# EAGLE design relay-attentuator-SMD (EAGLE 9.6.0)
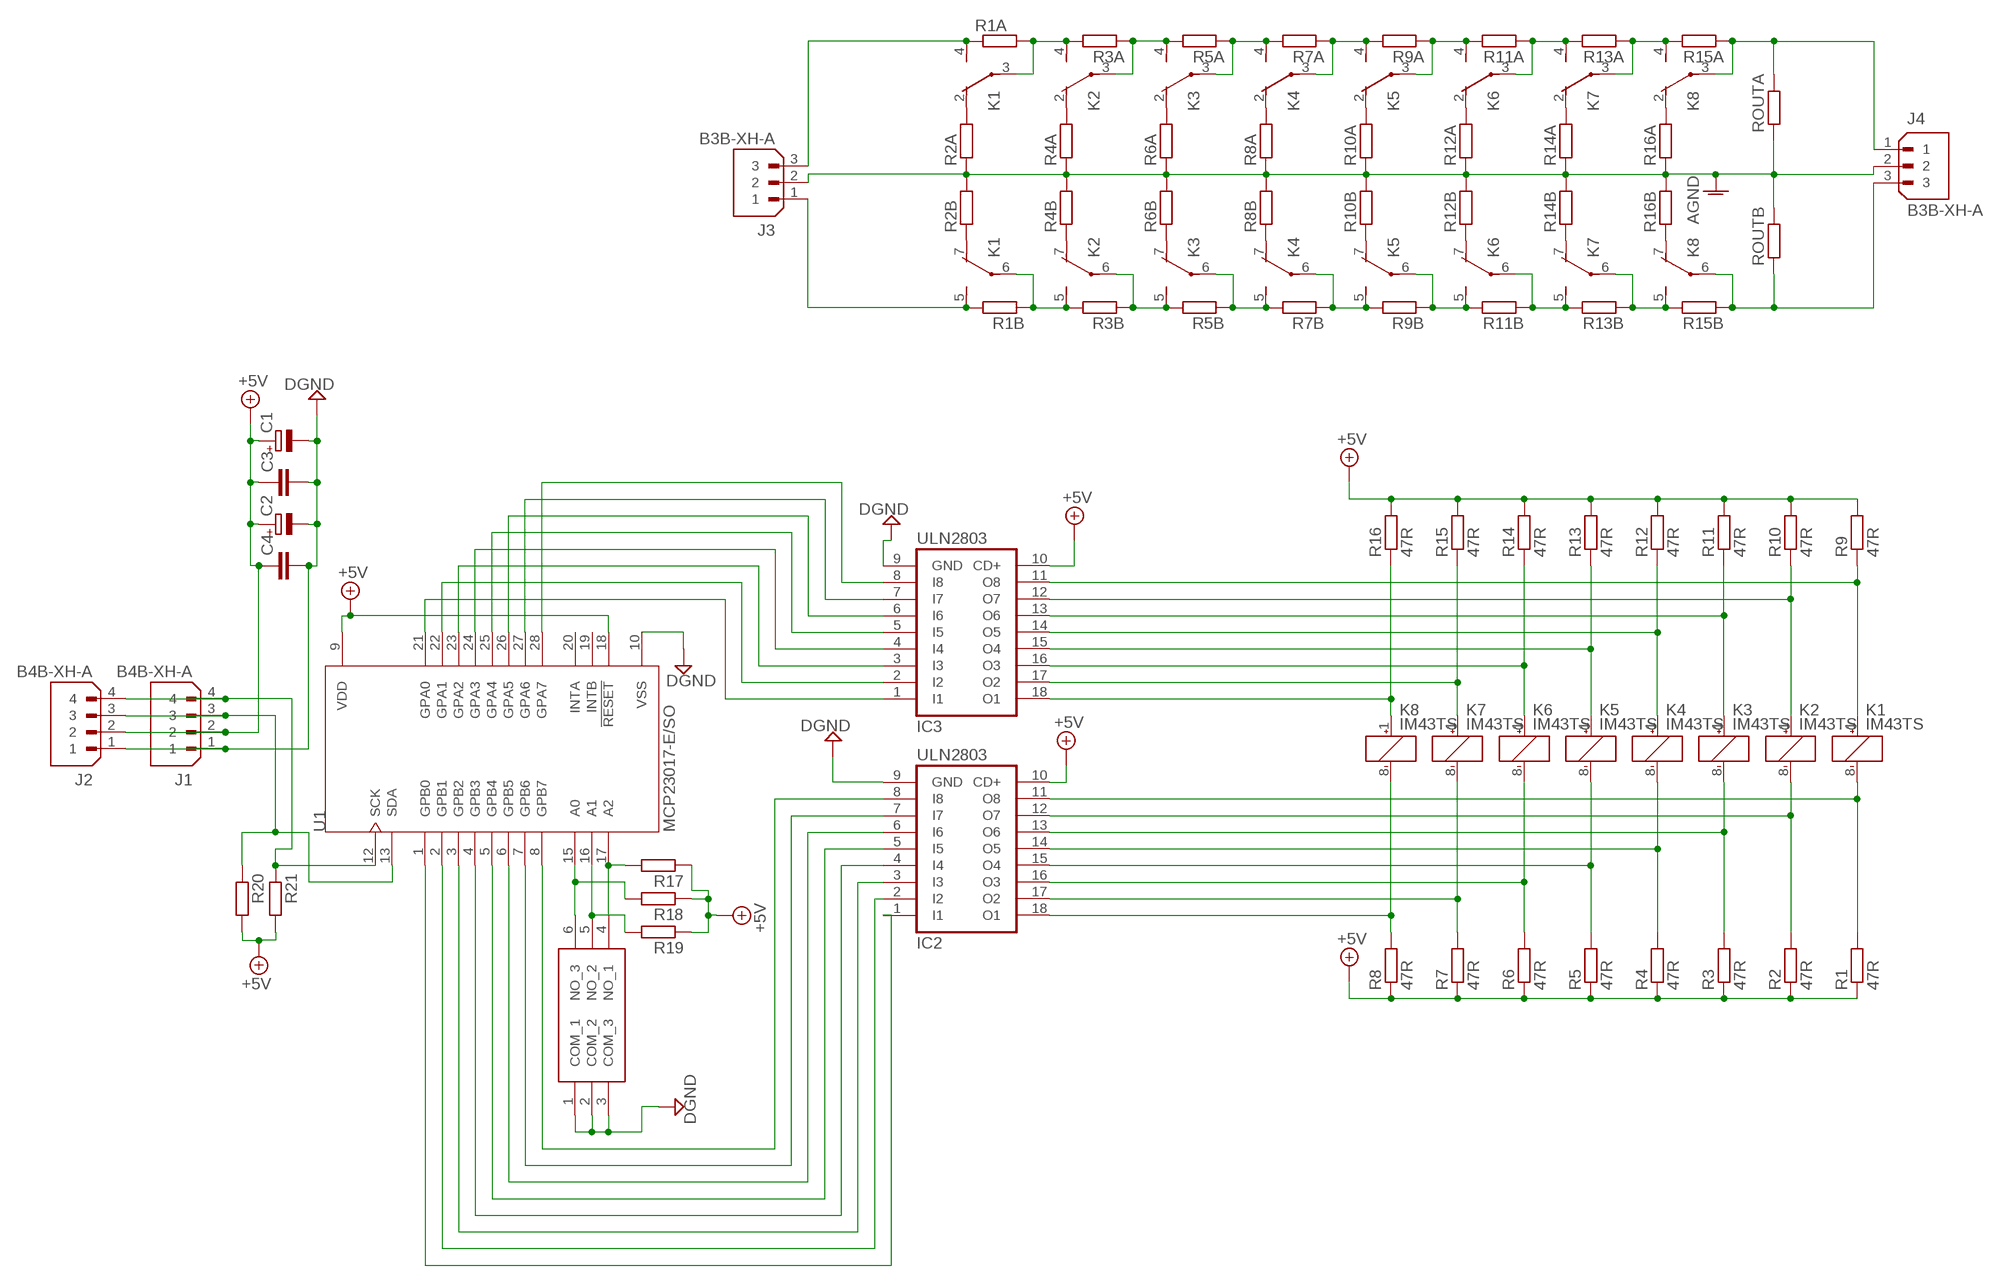
[diagram p0: schematic, sheet 1]

## Parts
C1  CPOL-EUE3.5-8  [E3,5-8]
C2  CPOL-EUE3.5-8  [E3,5-8]
C3  C-EUC1206  [C1206]
C4  C-EUC1206  [C1206]
IC2  ULN2803  ULN2803ADW  [SO-18W]
IC3  ULN2803  ULN2803ADW  [SO-18W]
J1  B4B-XH-A  [JST_B4B-XH-A]
J2  B4B-XH-A  [JST_B4B-XH-A]
J3  B3B-XH-A  [JST_B3B-XH-A]
J4  B3B-XH-A  [JST_B3B-XH-A]
K1  IM43TS  [IM43TS]
K2  IM43TS  [IM43TS]
K3  IM43TS  [IM43TS]
K4  IM43TS  [IM43TS]
K5  IM43TS  [IM43TS]
K6  IM43TS  [IM43TS]
K7  IM43TS  [IM43TS]
K8  IM43TS  [IM43TS]
R1  47R  R-EU_R1206  [R1206]
R1A  R-EU_R1206  [R1206]
R1B  R-EU_R1206  [R1206]
R2  47R  R-EU_R1206  [R1206]
R2A  R-EU_R1206  [R1206]
R2B  R-EU_R1206  [R1206]
R3  47R  R-EU_R1206  [R1206]
R3A  R-EU_R1206  [R1206]
R3B  R-EU_R1206  [R1206]
R4  47R  R-EU_R1206  [R1206]
R4A  R-EU_R1206  [R1206]
R4B  R-EU_R1206  [R1206]
R5  47R  R-EU_R1206  [R1206]
R5A  R-EU_R1206  [R1206]
R5B  R-EU_R1206  [R1206]
R6  47R  R-EU_R1206  [R1206]
R6A  R-EU_R1206  [R1206]
R6B  R-EU_R1206  [R1206]
R7  47R  R-EU_R1206  [R1206]
R7A  R-EU_R1206  [R1206]
R7B  R-EU_R1206  [R1206]
R8  47R  R-EU_R1206  [R1206]
R8A  R-EU_R1206  [R1206]
R8B  R-EU_R1206  [R1206]
R9  47R  R-EU_R1206  [R1206]
R9A  R-EU_R1206  [R1206]
R9B  R-EU_R1206  [R1206]
R10  47R  R-EU_R1206  [R1206]
R10A  R-EU_R1206  [R1206]
R10B  R-EU_R1206  [R1206]
R11  47R  R-EU_R1206  [R1206]
R11A  R-EU_R1206  [R1206]
R11B  R-EU_R1206  [R1206]
R12  47R  R-EU_R1206  [R1206]
R12A  R-EU_R1206  [R1206]
R12B  R-EU_R1206  [R1206]
R13  47R  R-EU_R1206  [R1206]
R13A  R-EU_R1206  [R1206]
R13B  R-EU_R1206  [R1206]
R14  47R  R-EU_R1206  [R1206]
R14A  R-EU_R1206  [R1206]
R14B  R-EU_R1206  [R1206]
R15  47R  R-EU_R1206  [R1206]
R15A  R-EU_R1206  [R1206]
R15B  R-EU_R1206  [R1206]
R16  47R  R-EU_R1206  [R1206]
R16A  R-EU_R1206  [R1206]
R16B  R-EU_R1206  [R1206]
R17  47R  R-EU_R1206  [R1206]
R18  47R  R-EU_R1206  [R1206]
R19  47R  R-EU_R1206  [R1206]
R20  47R  R-EU_R1206  [R1206]
R21  47R  R-EU_R1206  [R1206]
ROUTA  R-EU_R1206  [R1206]
ROUTB  R-EU_R1206  [R1206]
S1  2454982-2  [24549822]
U1  MCP23017-E/SO  [SOIC127P1030X265-28N]

## Nets
+5V: C1.+ C2.+ C3.1 C4.1 IC2.10(CD+) IC3.10(CD+) J1.2 J2.2 R1.1 R2.1 R3.1 R4.1 R5.1 R6.1 R7.1 R8.1 R9.2 R10.2 R11.2 R12.2 R13.2 R14.2 R15.2 R16.2 R17.1 R18.1 R19.1 R20.2 R21.2 U1.9(VDD) U1.18(!RESET)
AGND: J3.2 J4.2 R2A.1 R2B.2 R4A.1 R4B.2 R6A.1 R6B.2 R8A.1 R8B.2 R10A.1 R10B.2 R12A.1 R12B.2 R14A.1 R14B.2 R16A.1 R16B.2 ROUTA.1 ROUTB.2
ATT_INR: J3.1 K1.5(3:S) R1B.2
DGND: C1.- C2.- C3.2 C4.2 IC2.9(GND) IC3.9(GND) J1.1 J2.1 S1.1(COM_1) S1.2(COM_2) S1.3(COM_3) U1.10(VSS)
N$1: IC3.18(O1) K8.1(1:+) R16.1
N$2: IC2.11(O8) K1.8(1:-) R1.2
N$3: IC2.17(O2) K7.8(1:-) R7.2
N$4: IC2.13(O6) K3.8(1:-) R3.2
N$5: IC2.14(O5) K4.8(1:-) R4.2
N$6: K2.7(3:O) R4B.1
N$7: K1.7(3:O) R2B.1
N$8: K1.2(2:O) R2A.2
N$9: IC2.18(O1) K8.8(1:-) R8.2
N$10: IC3.17(O2) K7.1(1:+) R15.1
N$11: IC3.16(O3) K6.1(1:+) R14.1
N$12: IC3.15(O4) K5.1(1:+) R13.1
N$13: IC3.14(O5) K4.1(1:+) R12.1
N$14: IC3.13(O6) K3.1(1:+) R11.1
N$15: IC3.12(O7) K2.1(1:+) R10.1
N$16: IC3.11(O8) K1.1(1:+) R9.1
N$17: K3.7(3:O) R6B.1
N$18: IC2.12(O7) K2.8(1:-) R2.2
N$19: IC2.16(O3) K6.8(1:-) R6.2
N$20: IC2.15(O4) K5.8(1:-) R5.2
N$21: K4.7(3:O) R8B.1
N$22: K5.7(3:O) R10B.1
N$23: K6.7(3:O) R12B.1
N$24: K7.7(3:O) R14B.1
N$25: K8.7(3:O) R16B.1
N$26: K2.2(2:O) R4A.2
N$27: K3.2(2:O) R6A.2
N$28: K4.2(2:O) R8A.2
N$29: K5.2(2:O) R10A.2
N$30: K6.2(2:O) R12A.2
N$31: K7.2(2:O) R14A.2
N$32: K8.2(2:O) R16A.2
N$33: IC2.8(I8) U1.8(GPB7)
N$34: IC2.7(I7) U1.7(GPB6)
N$35: IC2.6(I6) U1.6(GPB5)
N$36: IC2.5(I5) U1.5(GPB4)
N$37: IC2.4(I4) U1.4(GPB3)
N$38: IC2.3(I3) U1.3(GPB2)
N$39: IC2.2(I2) U1.2(GPB1)
N$40: IC2.1(I1) U1.1(GPB0)
N$41: IC3.1(I1) U1.21(GPA0)
N$42: IC3.2(I2) U1.22(GPA1)
N$43: IC3.3(I3) U1.23(GPA2)
N$44: IC3.4(I4) U1.24(GPA3)
N$45: IC3.5(I5) U1.25(GPA4)
N$46: IC3.6(I6) U1.26(GPA5)
N$47: IC3.7(I7) U1.27(GPA6)
N$48: IC3.8(I8) U1.28(GPA7)
N$49: J3.3 K1.4(2:S) R1A.1
N$50: K7.6(3:P) K8.5(3:S) R13B.1 R15B.2
N$52: K7.3(2:P) K8.4(2:S) R13A.1 R15A.2
N$55: R18.2 S1.6(NO_3) U1.15(A0)
N$56: R19.2 S1.5(NO_2) U1.16(A1)
N$57: R17.2 S1.4(NO_1) U1.17(A2)
N$58: J1.3 J2.3 R20.1 U1.13(SDA)
N$59: J1.4 J2.4 R21.1 U1.12(SCK)
N$61: K6.6(3:P) K7.5(3:S) R11B.1 R13B.2
N$69: J4.3 K8.6(3:P) R15B.1 ROUTB.1
N$71: J4.1 K8.3(2:P) R15A.1 ROUTA.2
N$76: K1.3(2:P) K2.4(2:S) R1A.2 R3A.2
N$80: K2.3(2:P) K3.4(2:S) R3A.1 R5A.2
N$82: K1.6(3:P) K2.5(3:S) R1B.1 R3B.2
N$114: K3.3(2:P) K4.4(2:S) R5A.1 R7A.2
N$115: K4.3(2:P) K5.4(2:S) R7A.1 R9A.2
N$116: K5.3(2:P) K6.4(2:S) R9A.1 R11A.2
N$117: K6.3(2:P) K7.4(2:S) R11A.1 R13A.2
N$120: K2.6(3:P) K3.5(3:S) R3B.1 R5B.2
N$121: K3.6(3:P) K4.5(3:S) R5B.1 R7B.2
N$122: K4.6(3:P) K5.5(3:S) R7B.1 R9B.2
N$123: K5.6(3:P) K6.5(3:S) R9B.1 R11B.2
Unconnected: U1.19(INTB) U1.20(INTA)

## Library data of the parts
C1 C2 = rcl:CPOL-EU: POLARIZED CAPACITOR, European symbol
C3 C4 = rcl:C-EU: CAPACITOR, European symbol
IC2 IC3 = uln-udn-mine:ULN2803ADW
J1 J2 = B4B-XH-A:B4B-XH-A: Check availability <https://pricing.snapeda.com/parts/B4B-XH-A/JST%20Sales/view-part?ref=eda>; AVAILABILITY: In Stock; CHECK_PRICES: https://www.snapeda.com/parts/B4B-XH-A/JST+Sales+America+Inc./view-part/?ref=eda; DESCRIPTION: Connector Header Through Hole 4 position 0.098 (2.50mm); MF: JST Sales; MP: B4B-XH-A; PACKAGE: None; PRICE: None; SNAPEDA_LINK: https://www.snapeda.com/parts/B4B-XH-A/JST+Sales+America+Inc./view-part/?ref=snap
J3 J4 = B3B-XH-A:B3B-XH-A: Check availability <https://pricing.snapeda.com/parts/B3B-XH-A/JST%20Sales/view-part?ref=eda>; AVAILABILITY: In Stock; CHECK_PRICES: https://www.snapeda.com/parts/B3B-XH-A/JST+Sales+America+Inc./view-part/?ref=eda; DESCRIPTION: Connector Header Through Hole 3 position 0.098 (2.50mm); MF: JST Sales; MP: B3B-XH-A; PACKAGE: None; PRICE: None; SNAPEDA_LINK: https://www.snapeda.com/parts/B3B-XH-A/JST+Sales+America+Inc./view-part/?ref=snap
K1-K8 = relay-te:IM
R1 R1A R1B R2 R2A R2B R3 R3A R3B R4 R4A R4B R5 R5A R5B R6 R6A R6B R7 R7A R7B R8 R8A R8B R9 R9A R9B R10 R10A R10B R11 R11A R11B R12 R12A R12B R13 R13A R13B R14 R14A R14B R15 R15A R15B R16 R16A R16B R17-R21 ROUTA ROUTB = rcl:R-EU_: RESISTOR, European symbol
S1 = 2454982-2:2454982-2: DIP Switches / SIP Switches DIP, THT, 3 pos, extended Source: Datasheet; DESCRIPTION: DIP Switches / SIP Switches DIP, THT, 3 pos, extended; HEIGHT: 4.51mm; MANUFACTURER_NAME: TE Connectivity; MANUFACTURER_PART_NUMBER: 2454982-2; MOUSER_PART_NUMBER: 655-2454982-2; MOUSER_PRICE-STOCK: https://www.mouser.co.uk/ProductDetail/TE-Connectivity-Alcoswitch/2454982-2?qs=1Kr7Jg1SGW%2FyvNyTL9wDrw%3D%3D
U1 = MCP23017-E_SO:MCP23017-E/SO: MCP23017 Series 5.5 V 1.7 MHz SMT 16-Bit I2C I/O Expander - SOIC-28 Check availability <https://pricing.snapeda.com/parts/MCP23017-E/SO/Microchip/view-part?ref=eda>; AVAILABILITY: In Stock; CHECK_PRICES: https://www.snapeda.com/parts/MCP23017-E/SO/Microchip/view-part/?ref=eda; DESCRIPTION: I/O Port Expander, 16-Bit, I2C I'face, SOIC-28 | Microchip Technology Inc. MCP23017-E/SO; MF: Microchip; MP: MCP23017-E/SO; PACKAGE: SOIC-28 Microchip; PRICE: None; SNAPEDA_LINK: https://www.snapeda.com/parts/MCP23017-E/SO/Microchip/view-part/?ref=snap

## Board
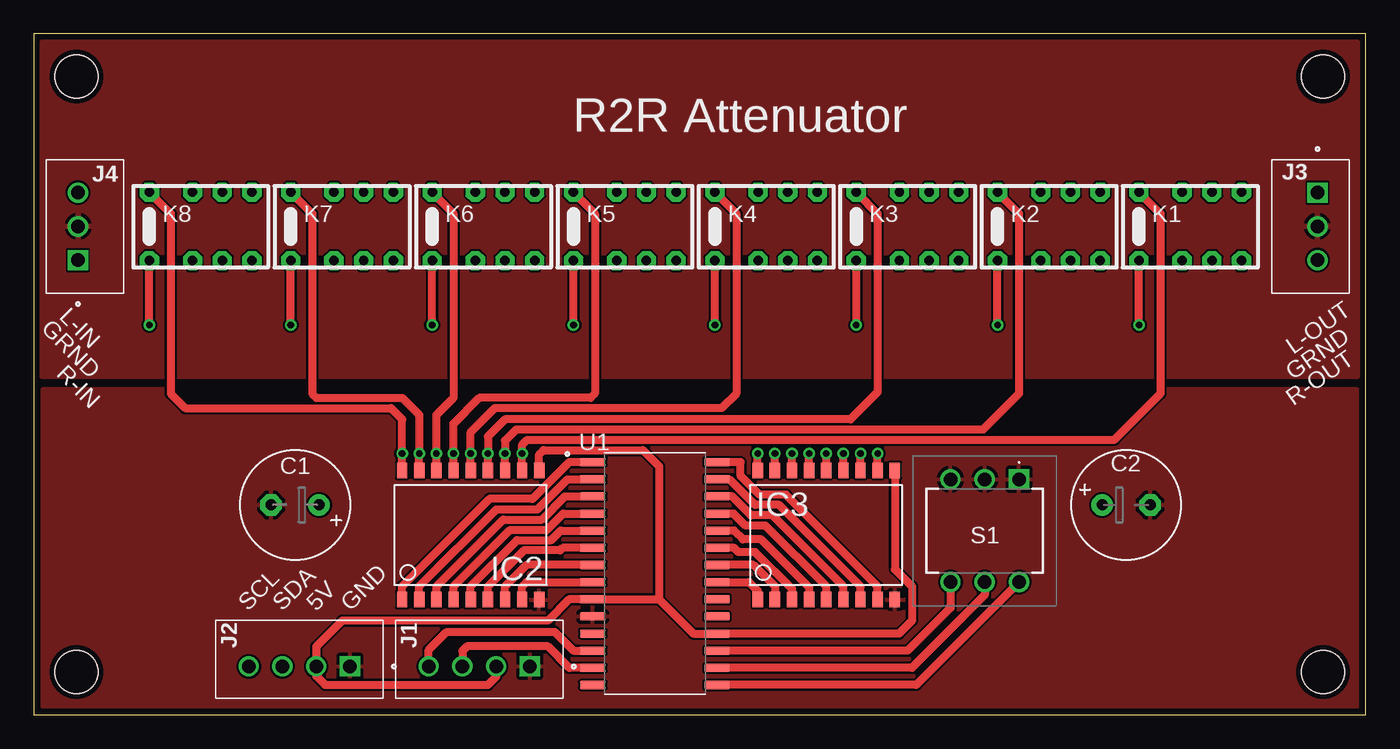
[diagram p1: board, top side]
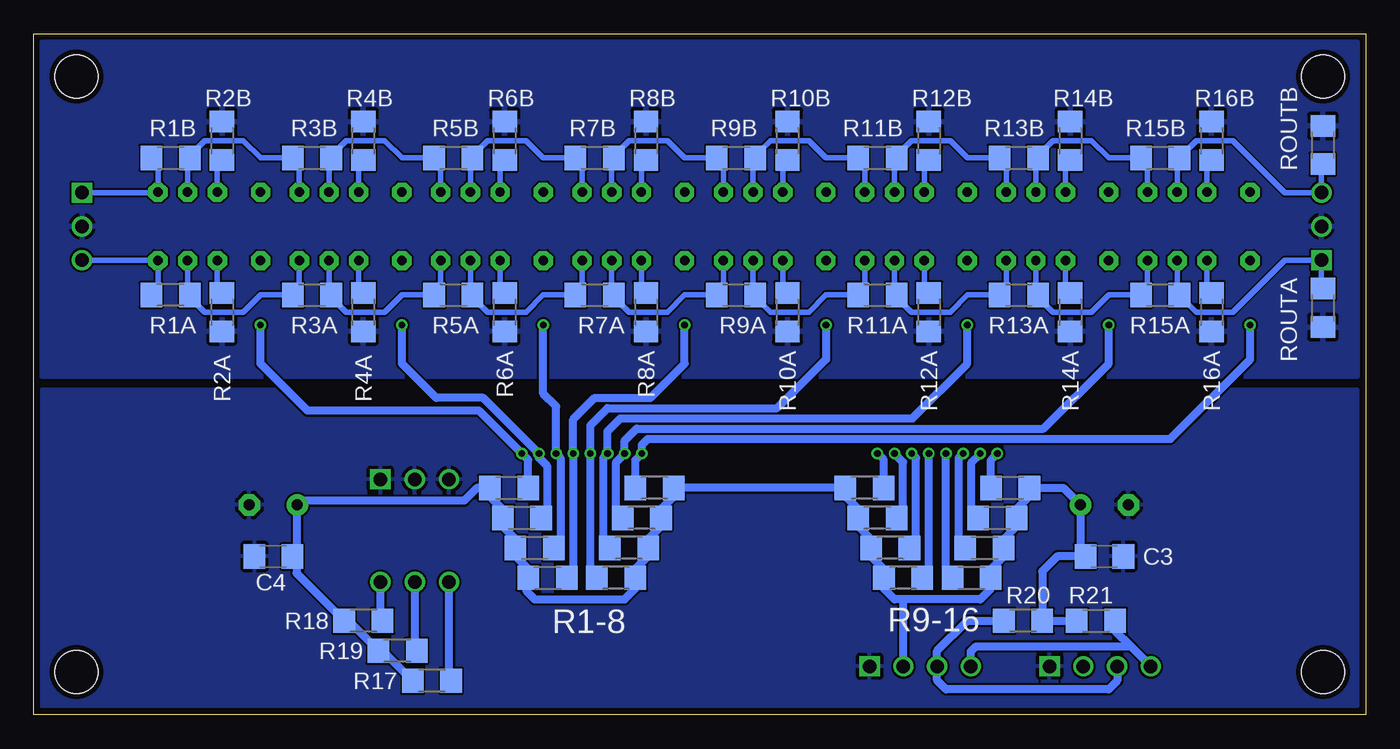
[diagram p2: board, bottom side, seen from below]

Size 98.72 x 50.47 mm. Coordinates in mm from the lower left corner, seen from the top.
Outline: 0,0 98.72,0 98.72,50.47 0,50.47 0,0
Copper layers (1*16): Top 0.0356mm / dielectric 1.5011mm / Bottom 0.0356mm
Design rules "LaenPCBOrder": minimum track width 6mil, minimum drill 13mil, track to track 6mil, track to pad 6mil, pad to pad 6mil, via to via 6mil, smd to smd 6mil, copper to edge 15mil, drill to drill 6mil, minimum pad ring 7mil, minimum via ring 7mil, stop-mask expansion 3mil, vias tented up to drill 0mil, thermal gap 10mil
Holes 3.2 mm at 95.57,47.31 95.57,3.18 3.17,3.18 3.17,47.31

### Footprints (pad centres in the part's own frame; a part is rotated, then mirrored left to right if it is on the bottom)
E3,5-8 = drill 0.813 pad 1.6: + -1.778,0 | drill 0.813 pad 1.6 octagon: - 1.778,0
C1206 = smd 1.6 x 1.8: 1 -1.4,0; 2 1.4,0
SO-18W = smd 0.762 x 1.143: 1 -5.08,-4.788; 2 -3.81,-4.788; 3 -2.54,-4.788; 4 -1.27,-4.788; 5 0,-4.788; 6 1.27,-4.788; 7 2.54,-4.788; 8 3.81,-4.788; 9 5.08,-4.788; 10 5.08,4.788; 11 3.81,4.788; 12 2.54,4.788; 13 1.27,4.788; 14 0,4.788; 15 -1.27,4.788; 16 -2.54,4.788; 17 -3.81,4.788; 18 -5.08,4.788
JST_B4B-XH-A = drill 1 square: 1 3.75,-0.525 | drill 1: 2 1.25,-0.525; 3 -1.25,-0.525; 4 -3.75,-0.525
JST_B3B-XH-A = drill 1 square: 1 2.5,-0.525 | drill 1: 2 0,-0.525; 3 -2.5,-0.525
IM43TS = drill 0.7 pad 1.422 octagon: 1 2.54,-3.81; 2 2.54,-0.61; 3 2.54,1.59; 4 2.54,3.79; 5 -2.54,3.79; 6 -2.54,1.59; 7 -2.54,-0.61; 8 -2.54,-3.81
R1206 = smd 1.6 x 1.803: 1 -1.422,0; 2 1.422,0
24549822 = drill 1 pad 1.5 square: 1 0,0 | drill 1 pad 1.5: 2 2.54,0; 3 5.08,0; 4 5.08,7.62; 5 2.54,7.62; 6 0,7.62
SOIC127P1030X265-28N = smd 1.9 x 0.6: 1 -4.605,8.255; 2 -4.605,6.985; 3 -4.605,5.715; 4 -4.605,4.445; 5 -4.605,3.175; 6 -4.605,1.905; 7 -4.605,0.635; 8 -4.605,-0.635; 9 -4.605,-1.905; 10 -4.605,-3.175; 11 -4.605,-4.445; 12 -4.605,-5.715; 13 -4.605,-6.985; 14 -4.605,-8.255; 15 4.605,-8.255; 16 4.605,-6.985; 17 4.605,-5.715; 18 4.605,-4.445; 19 4.605,-3.175; 20 4.605,-1.905; 21 4.605,-0.635; 22 4.605,0.635; 23 4.605,1.905; 24 4.605,3.175; 25 4.605,4.445; 26 4.605,5.715; 27 4.605,6.985; 28 4.605,8.255

### Placement (x,y rotation side)
C1  19.37,15.56 180 top
C2  80.96,15.56 0 top
C3  19.37,11.75 0 bottom
C4  80.96,11.75 180 bottom
IC2  32.38,13.33 0 top
IC3  58.74,13.33 0 top
J1  33.02,4.13 0 top
J2  19.68,4.13 0 top
J3  94.61,36.19 90 top
J4  3.81,36.19 270 top
K1  85.72,36.19 270 top
K2  75.25,36.19 270 top
K3  64.77,36.19 270 top
K4  54.29,36.19 270 top
K5  43.81,36.19 270 top
K6  33.34,36.19 270 top
K7  22.86,36.19 270 top
K8  12.38,36.19 270 top
R1  37.15,16.83 0 bottom
R1A  88.58,31.11 0 bottom
R1B  88.58,41.27 180 bottom
R2  36.2,14.61 0 bottom
R2A  84.77,29.85 90 bottom
R2B  84.77,42.55 90 bottom
R3  35.24,12.38 0 bottom
R3A  78.11,31.11 180 bottom
R3B  78.11,41.27 180 bottom
R4  34.29,10.16 0 bottom
R4A  74.3,29.85 90 bottom
R4B  74.3,42.55 90 bottom
R5  29.21,10.16 180 bottom
R5A  67.63,31.11 180 bottom
R5B  67.63,41.27 180 bottom
R6  28.26,12.38 180 bottom
R6A  63.82,29.85 90 bottom
R6B  63.82,42.55 90 bottom
R7  27.3,14.61 180 bottom
R7A  57.15,31.11 180 bottom
R7B  57.15,41.27 180 bottom
R8  26.35,16.83 180 bottom
R8A  53.34,29.85 90 bottom
R8B  53.34,42.55 90 bottom
R9  63.5,16.83 180 bottom
R9A  46.67,31.11 180 bottom
R9B  46.67,41.27 180 bottom
R10  62.55,14.61 180 bottom
R10A  42.86,29.85 90 bottom
R10B  42.86,42.55 90 bottom
R11  61.59,12.38 180 bottom
R11A  36.2,31.11 180 bottom
R11B  36.2,41.27 180 bottom
R12  60.64,10.16 180 bottom
R12A  32.38,29.85 90 bottom
R12B  32.38,42.55 90 bottom
R13  55.56,10.16 0 bottom
R13A  25.72,31.11 180 bottom
R13B  25.72,41.27 180 bottom
R14  54.61,12.38 0 bottom
R14A  21.91,29.85 90 bottom
R14B  21.91,42.55 90 bottom
R15  53.66,14.61 0 bottom
R15A  15.24,31.11 180 bottom
R15B  15.24,41.27 180 bottom
R16  52.7,16.83 0 bottom
R16A  11.43,29.85 90 bottom
R16B  11.43,42.55 90 bottom
R17  69.22,2.54 0 bottom
R18  74.3,6.99 0 bottom
R19  71.75,4.76 0 bottom
R20  25.4,6.99 0 bottom
R21  20,6.99 180 bottom
ROUTA  3.17,30.16 90 bottom
ROUTB  3.17,42.23 90 bottom
S1  73.03,17.46 180 top
U1  46.04,10.48 0 top

### Tracks (layer width: path | path; a pad name or v marks a point on that pad's centre or on a via)
+5V
  Top 0.61: 46.35,8.57 U1.9 39.69,8.57 38.1,6.99 22.86,6.99 20.93,5.06 J2.2 20.95,3.58 20.95,2.86 21.59,2.22 33.66,2.22 34.27,2.84 J1.2 | 46.35,8.57 48.9,6.03 U1.18 64.14,6.03 65.09,6.99 65.09,9.53 63.82,10.79 IC3.10 | 46.35,8.57 46.35,18.42 45.15,19.62 37.78,19.62 37.47,19.3 IC2.10
  Bottom 0.61: 34.29,8.57 28.57,8.57 27.79,9.36 R5.1 27.79,10.79 26.84,11.75 R6.1 26.84,13.02 25.88,13.97 R7.1 25.88,15.24 24.93,16.19 R8.1 22.42,16.83 C1.+ 21.14,12.13 C3.1 22.86,11.75 23.98,10.63 R20.2 R21.2 | 34.29,8.57 34.92,8.57 35.71,9.36 R4.1 35.71,10.79 36.66,11.75 R3.1 36.66,13.02 37.62,13.97 R2.1 37.62,15.24 38.57,16.19 R1.1 R16.2 51.28,16.19 52.24,15.24 R15.2 52.24,13.97 53.19,13.02 R14.2 53.19,11.75 54.14,10.79 R13.2 54.14,9.36 54.93,8.57 61.59,8.57 62.23,9.21 62.23,9.99 R12.2 62.06,10.79 63.02,11.75 R11.2 63.02,13.02 63.97,13.97 R10.2 63.97,15.24 64.92,16.19 R9.2 65.87,16.83 66.83,15.88 78.87,15.88 C2.+ 79.18,12.13 C4.1 79.25,11.43 79.25,10.51 R18.1 75.4,6.99 R19.1 72.86,4.76 R17.1 | J1.2 34.27,8.55 34.29,8.57
AGND
  pour Top: 0.64,49.85 98.11,49.85 98.11,25.08 0.64,25.08
  pour Bottom: 0.64,49.85 98.11,49.85 98.11,25.08 0.64,25.08
ATT_INR
  Bottom 0.406: R1B.2 89.52,40.79 K1.5 89.56,38.69 J3.1
DGND
  pour Bottom: 0.64,24.13 0.64,0.64 98.11,0.64 98.11,24.13
  pour Top: 0.64,24.13 0.64,0.64 98.11,0.64 98.11,24.13
N$1  (via drill 0.5 pad 0.25)
  Top 0.61: IC3.18 v53.66,19.37 | v8.57,28.89 K8.1
  Bottom 0.61: v8.57,28.89 8.57,26.35 14.48,20.45 53.21,20.45 53.66,20 v53.66,19.37 54.13,18.9 R16.1
N$2  (via drill 0.5 pad 0.25)
  Top 0.61: K1.8 83.5,37.15 83.5,23.81 80.07,20.38 36.58,20.38 36.2,20 v36.2,19.37 IC2.11
  Bottom 0.61: v36.2,19.37 35.73,18.9 R1.2
N$3  (via drill 0.5 pad 0.25)
  Top 0.61: K7.8 20.64,37.15 20.64,23.81 20.95,23.5 27.3,23.5 28.57,22.22 v28.57,19.37 IC2.17
  Bottom 0.61: R7.2 29.21,15.09 29.21,18.73 v28.57,19.37
N$4  (via drill 0.5 pad 0.25)
  Top 0.61: K3.8 62.55,37.15 62.55,23.91 60.54,21.91 34.92,21.91 33.66,20.64 v33.66,19.37 IC2.13
  Bottom 0.61: R3.2 33.34,12.87 33.34,19.05 v33.66,19.37
N$5  (via drill 0.5 pad 0.25)
  Top 0.61: K4.8 52.07,37.15 52.07,23.81 50.99,22.73 34.16,22.73 32.38,20.96 v32.38,19.37 IC2.14
  Bottom 0.61: R4.2 32.38,10.64 v32.38,19.37
N$6
  Bottom 0.406: K2.7 74.64,40.46 R4B.1
N$7
  Bottom 0.406: K1.7 85.11,40.46 R2B.1
N$8
  Bottom 0.406: K1.2 85.11,31.93 R2A.2
N$9  (via drill 0.5 pad 0.25)
  Top 0.61: K8.8 10.16,37.15 10.16,23.81 11.24,22.73 26.48,22.73 27.3,21.91 v27.3,19.37 IC2.18
  Bottom 0.61: R8.2 27.77,18.9 v27.3,19.37
N$10  (via drill 0.5 pad 0.25)
  Top 0.61: IC3.17 v54.93,19.37 | v19.05,28.89 K7.1
  Bottom 0.61: v19.05,28.89 19.05,26.04 23.88,21.21 54.04,21.21 54.93,20.32 v54.93,19.37 55.56,18.73 55.56,15.09 R15.1
N$11  (via drill 0.5 pad 0.25)
  Top 0.61: IC3.16 v56.2,19.37 | v29.53,28.89 K6.1
  Bottom 0.61: v29.53,28.89 29.53,26.04 33.59,21.97 55.24,21.97 56.2,21.02 v56.2,19.37 56.52,19.05 56.52,12.87 R14.1
N$12  (via drill 0.5 pad 0.25)
  Top 0.61: IC3.15 v57.47,19.37 | v40.01,28.89 K5.1
  Bottom 0.61: v40.01,28.89 40.01,26.35 43.62,22.73 56.2,22.73 57.47,21.46 v57.47,19.37 57.47,10.64 R13.1
N$13  (via drill 0.5 pad 0.25)
  Top 0.61: IC3.14 v58.74,19.37 | v50.48,28.89 K4.1
  Bottom 0.61: v50.48,28.89 50.48,26.04 53.02,23.5 57.15,23.5 58.74,21.91 v58.74,19.37 58.74,10.64 R12.1
N$14  (via drill 0.5 pad 0.25)
  Top 0.61: IC3.13 v60.01,19.37 | v60.96,28.89 K3.1
  Bottom 0.61: v60.96,28.89 60.96,23.81 60.01,22.86 v60.01,19.37 59.69,19.05 59.69,12.87 R11.1
N$15  (via drill 0.5 pad 0.25)
  Top 0.61: IC3.12 v61.28,19.37 | v71.44,28.89 K2.1
  Bottom 0.61: v71.44,28.89 71.44,26.04 68.9,23.5 65.41,23.5 v61.28,19.37 61.28,19.05 60.64,18.42 60.64,15.09 R10.1
N$16  (via drill 0.5 pad 0.25)
  Top 0.61: IC3.11 v62.55,19.37 | v81.92,28.89 K1.1
  Bottom 0.61: v81.92,28.89 81.92,26.04 78.42,22.54 65.72,22.54 v62.55,19.37 62.08,18.9 R9.1
N$17
  Bottom 0.406: K3.7 64.16,40.46 R6B.1
N$18  (via drill 0.5 pad 0.25)
  Top 0.61: K2.8 73.03,37.15 73.03,23.81 70.36,21.15 35.75,21.15 34.92,20.32 v34.92,19.37 IC2.12
  Bottom 0.61: R2.2 34.29,15.09 34.29,18.73 v34.92,19.37
N$19  (via drill 0.5 pad 0.25)
  Top 0.61: K6.8 31.11,37.15 31.11,23.5 29.84,22.22 v29.84,19.37 IC2.16
  Bottom 0.61: R6.2 30.16,12.87 30.16,19.05 v29.84,19.37
N$20  (via drill 0.5 pad 0.25)
  Top 0.61: K5.8 41.59,37.15 41.59,23.81 41.27,23.5 33.02,23.5 31.11,21.59 v31.11,19.37 IC2.15
  Bottom 0.61: R5.2 31.11,10.64 v31.11,19.37
N$21
  Bottom 0.406: K4.7 53.68,40.46 R8B.1
N$22
  Bottom 0.406: K5.7 43.2,40.46 R10B.1
N$23
  Bottom 0.406: K6.7 32.73,40.46 R12B.1
N$24
  Bottom 0.406: K7.7 22.25,40.46 R14B.1
N$25
  Bottom 0.406: K8.7 11.77,40.46 R16B.1
N$26
  Bottom 0.406: K2.2 74.64,31.93 R4A.2
N$27
  Bottom 0.406: K3.2 64.16,31.93 R6A.2
N$28
  Bottom 0.406: K4.2 53.68,31.93 R8A.2
N$29
  Bottom 0.406: K5.2 43.2,31.93 R10A.2
N$30
  Bottom 0.406: K6.2 32.73,31.93 R12A.2
N$31
  Bottom 0.406: K7.2 22.25,31.93 R14A.2
N$32
  Bottom 0.406: K8.2 11.77,31.93 R16A.2
N$33
  Top 0.61: IC2.8 36.2,9.53 36.51,9.84 U1.8
N$34
  Top 0.61: IC2.7 34.92,9.53 36.51,11.11 U1.7
N$35
  Top 0.61: IC2.6 33.66,9.53 36.32,12.19 39.02,12.19 39.21,12.38 U1.6
N$36
  Top 0.61: IC2.5 32.38,9.53 35.81,12.95 38.35,12.95 39.05,13.65 U1.5
N$37
  Top 0.61: IC2.4 31.11,9.53 35.31,13.72 38.04,13.72 39.24,14.92 U1.4
N$38
  Top 0.61: IC2.3 29.84,9.53 34.8,14.48 37.66,14.48 39.37,16.19 U1.3
N$39
  Top 0.61: IC2.2 28.57,9.53 34.29,15.24 37.34,15.24 39.56,17.46 U1.2
N$40
  Top 0.61: IC2.1 27.3,9.53 33.78,16 36.96,16 39.69,18.73 U1.1
N$41
  Top 0.61: U1.21 53.02,9.84 53.66,9.21 IC3.1
N$42
  Top 0.61: U1.22 53.34,11.11 54.93,9.53 IC3.2
N$43
  Top 0.61: U1.23 51.91,12.38 52.23,12.07 53.47,12.07 56.2,9.33 IC3.3
N$44
  Top 0.61: U1.24 51.91,13.65 52.55,13.02 53.91,13.02 57.47,9.46 IC3.4
N$45
  Top 0.61: IC3.5 58.74,9.53 54.23,14.03 52.77,14.03 51.88,14.92 U1.25
N$46
  Top 0.61: IC3.6 60.01,9.53 54.74,14.79 53.15,14.79 51.75,16.19 U1.26
N$47
  Top 0.61: IC3.7 61.28,9.53 55.24,15.56 53.47,15.56 51.56,17.46 U1.27
N$48
  Top 0.61: IC3.8 62.55,9.53 55.75,16.32 53.78,16.32 52.39,17.71 52.39,18.73 U1.28
N$49
  Bottom 0.406: R1A.1 89.52,31.6 K1.4 89.56,33.7 J3.3
N$50
  Bottom 0.406: K7.6 24.45,41.12 R13B.1 24.3,41.43 23.18,42.55 20.32,42.55 19.05,41.27 R15B.2 16.17,40.79 K8.5
N$52
  Bottom 0.406: K8.4 16.17,31.6 R15A.2 19.05,31.11 20.32,29.85 23.18,29.85 24.3,30.96 R13A.1 24.45,31.27 K7.3
N$55
  Top 0.61: S1.6 65.41,2.22 U1.15
  Bottom 0.61: R18.2 73.03,7.14 S1.6
N$56
  Top 0.61: S1.5 70.48,8.89 65.09,3.49 U1.16
  Bottom 0.61: S1.5 70.48,4.91 R19.2
N$57
  Top 0.61: S1.4 67.94,7.94 64.77,4.76 U1.17
  Bottom 0.61: R17.2 67.94,2.69 S1.4
N$58
  Top 0.61: U1.13 39.69,3.49 38.1,5.08 32.11,5.08 31.77,4.74 J1.3
  Bottom 0.61: J2.3 18.41,3.58 18.41,2.54 19.05,1.91 31.11,1.91 31.77,2.56 J1.3 31.77,4.74 29.53,6.99 R20.1
N$59
  Top 0.61: J1.4 29.27,4.82 30.61,6.16 38.61,6.16 40.01,4.76 U1.12
  Bottom 0.61: J1.4 29.27,4.7 28.89,5.08 17.41,5.08 | R21.1 18.58,6.25 17.41,5.08 | J2.4 17.28,4.95 17.41,5.08
N$61
  Bottom 0.406: K6.6 34.93,41.12 R11B.1 34.77,41.43 33.66,42.55 30.8,42.55 29.53,41.27 R13B.2 26.65,40.79 K7.5
N$69
  Bottom 0.406: K8.6 13.97,41.12 R15B.1 12.55,42.55 9.84,42.55 5.99,38.69 J4.3 3.29,40.69 ROUTB.1
N$71
  Bottom 0.406: K8.3 13.97,31.27 R15A.1 12.55,29.85 9.84,29.85 5.99,33.7 J4.1 3.29,31.7 ROUTA.2
N$76
  Bottom 0.406: K1.3 87.31,31.27 R1A.2 87.16,30.96 86.04,29.85 83.19,29.85 81.92,31.11 R3A.2 79.04,31.6 K2.4
N$80
  Bottom 0.406: K2.3 76.84,31.27 R3A.1 76.68,30.96 75.56,29.85 72.71,29.85 71.44,31.11 R5A.2 68.56,31.6 K3.4
N$82
  Bottom 0.406: K1.6 87.31,41.12 R1B.1 87.16,41.43 86.04,42.55 83.19,42.55 81.92,41.27 R3B.2 79.04,40.79 K2.5
N$114
  Bottom 0.406: K3.3 66.36,31.27 R5A.1 66.21,30.96 65.09,29.85 62.23,29.85 60.96,31.11 R7A.2 58.08,31.6 K4.4
N$115
  Bottom 0.406: K4.3 55.88,31.27 R7A.1 55.73,30.96 54.61,29.85 51.75,29.85 50.48,31.11 R9A.2 47.6,31.6 K5.4
N$116
  Bottom 0.406: K5.3 45.41,31.27 R9A.1 45.25,30.96 44.13,29.85 41.27,29.85 40.01,31.11 R11A.2 37.13,31.6 K6.4
N$117
  Bottom 0.406: K6.3 34.93,31.27 R11A.1 34.77,30.96 33.66,29.85 30.8,29.85 29.53,31.11 R13A.2 26.65,31.6 K7.4
N$120
  Bottom 0.406: K2.6 76.84,41.12 R3B.1 76.68,41.43 75.56,42.55 72.71,42.55 71.44,41.27 R5B.2 68.56,40.79 K3.5
N$121
  Bottom 0.406: K3.6 66.36,41.12 R5B.1 66.21,41.43 65.09,42.55 62.23,42.55 60.96,41.27 R7B.2 58.08,40.79 K4.5
N$122
  Bottom 0.406: K4.6 55.88,41.12 R7B.1 55.73,41.43 54.61,42.55 51.75,42.55 50.48,41.27 R9B.2 47.6,40.79 K5.5
N$123
  Bottom 0.406: K5.6 45.41,41.12 R9B.1 45.25,41.43 44.13,42.55 41.27,42.55 40.01,41.27 R11B.2 37.13,40.79 K6.5

### Text on the board
tNames: R2R Attenuator | L-IN | L-OUT | GRND | GRND | R-IN | R-OUT | SCL | SDA | 5V | GND
bNames: R9-16 | R1-8